# EAGLE schematic current_sensor (EAGLE 9.4.2)
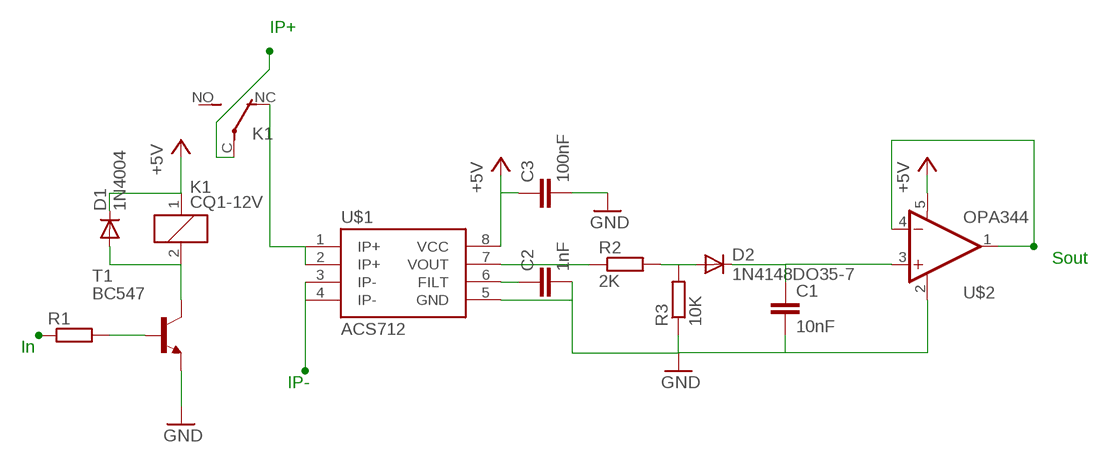
[diagram p0: schematic, sheet 1]

## Parts
C1  10nF  C5/2.5  [C5B2.5]
C2  1nF  C7.5/3  [C7.5B3]
C3  100nF  C7.5/3  [C7.5B3]
D1  1N4004  [DO41-10]
D2  1N4148DO35-7  [DO35-7]
K1  CQ1-12V  [CQ1]
R1  R-EU_0207/12  [0207/12]
R2  2K  R-EU_0207/12  [0207/12]
R3  10K  R-EU_0207/12  [0207/12]
T1  BC547  [TO92]
U$1  ACS712  [SO08]
U$2  OPA344  [SOT23-5]

## Nets
+5V: C3.1 D1.C K1.1 U$1.8(VCC) U$2.5(V+)
GND: C1.2 C2.2 C3.2 R3.1 T1.1(E) U$1.5(GND) U$2.2(V-)
N$1: D1.A K1.2 T1.3(C)
N$2: C2.1 U$1.6(FILT)
N$3: R1.2 T1.2(B)
N$4: D2.A R2.2 R3.2
N$5: C1.1 D2.C U$2.3(+IN)
N$6: R2.1 U$1.7(VOUT)
N$7: K1.NC(2:O) U$1.1(IP+) U$1.2(IP+)
N$8: U$2.1(OUT) U$2.4(-IN)
N$9: U$1.3(IP-) U$1.4(IP-)
N$10: K1.C(2:P)
N$11: R1.1
Unconnected: K1.NO(2:S)

## Notes on the sheet
- IP+
- Sout
- In
- IP-

## Library data of the parts
C1-C3 = capacitor-wima:C: CAPACITOR naming: grid - package width
D1 = diode:1N4004: DIODE general purpose rectifier, 1 A
D2 = diode:1N4148: DIODE high speed (Philips)
K1 = relay:CQ1-12V: AUTOMOTIVE QUIET RELAY NAiS Source: http://www.mew-europe.com/.. en_ds_61208_0000.pdf; OC_FARNELL: unknown; OC_NEWARK: unknown
R1-R3 = rcl:R-EU_: RESISTOR, European symbol
T1 = transistor:BC547: NPN TRANSISTOR
U$1 = SparkFun:ACS712
U$2 = SparkFun:OPA344